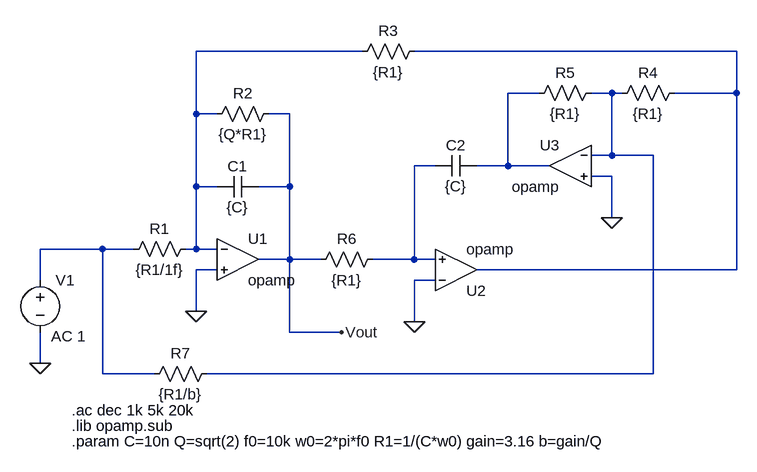
[diagram p0: schematic TS6_standalone.asc]
TS6_standalone.asc, the LTspice schematic file:
Version 4
SHEET 1 880 680
WIRE 96 -160 -160 -160
WIRE 672 -160 176 -160
WIRE 368 -96 320 -96
WIRE 480 -96 448 -96
WIRE 496 -96 480 -96
WIRE 672 -96 672 -160
WIRE 672 -96 576 -96
WIRE -160 -64 -160 -160
WIRE -128 -64 -160 -64
WIRE -16 -64 -48 -64
WIRE 480 0 480 -96
WIRE 480 0 448 0
WIRE 544 0 480 0
WIRE 208 16 176 16
WIRE 320 16 320 -96
WIRE 320 16 272 16
WIRE 384 16 320 16
WIRE 480 32 448 32
WIRE -160 48 -160 -64
WIRE -128 48 -160 48
WIRE -16 48 -16 -64
WIRE -16 48 -64 48
WIRE 480 96 480 32
WIRE -304 144 -400 144
WIRE -256 144 -304 144
WIRE -160 144 -160 48
WIRE -160 144 -176 144
WIRE -128 144 -160 144
WIRE -16 160 -16 48
WIRE -16 160 -64 160
WIRE 32 160 -16 160
WIRE 176 160 176 16
WIRE 176 160 112 160
WIRE 208 160 176 160
WIRE -128 176 -160 176
WIRE 672 176 672 -96
WIRE 672 176 272 176
WIRE -400 192 -400 144
WIRE 208 192 176 192
WIRE -160 240 -160 176
WIRE 176 256 176 192
WIRE -16 272 -16 160
WIRE 64 272 -16 272
WIRE -400 320 -400 272
WIRE -304 336 -304 144
WIRE -224 336 -304 336
WIRE 544 336 544 0
WIRE 544 336 -144 336
FLAG -400 320 0
FLAG -160 240 0
FLAG 176 256 0
FLAG 480 96 0
FLAG 64 272 Vout
SYMBOL OpAmps\\opamp -96 96 R0
SYMATTR InstName U1
SYMBOL voltage -400 176 R0
WINDOW 123 17 102 Left 2
WINDOW 39 0 0 Left 0
SYMATTR Value2 AC 1
SYMATTR InstName V1
SYMATTR Value ""
SYMBOL OpAmps\\opamp 240 240 M180
SYMATTR InstName U2
SYMBOL OpAmps\\opamp 416 -48 M0
SYMATTR InstName U3
SYMBOL res -160 128 R90
WINDOW 0 0 56 VBottom 2
WINDOW 3 32 56 VTop 2
SYMATTR InstName R1
SYMATTR Value {R1/1f}
SYMBOL res -32 -80 R90
WINDOW 0 0 56 VBottom 2
WINDOW 3 32 56 VTop 2
SYMATTR InstName R2
SYMATTR Value {Q*R1}
SYMBOL cap -64 32 R90
WINDOW 0 0 32 VBottom 2
WINDOW 3 32 32 VTop 2
SYMATTR InstName C1
SYMATTR Value {C}
SYMBOL res 192 -176 R90
WINDOW 0 0 56 VBottom 2
WINDOW 3 32 56 VTop 2
SYMATTR InstName R3
SYMATTR Value {R1}
SYMBOL res 592 -112 R90
WINDOW 0 0 56 VBottom 2
WINDOW 3 32 56 VTop 2
SYMATTR InstName R4
SYMATTR Value {R1}
SYMBOL res 464 -112 R90
WINDOW 0 0 56 VBottom 2
WINDOW 3 32 56 VTop 2
SYMATTR InstName R5
SYMATTR Value {R1}
SYMBOL cap 272 0 R90
WINDOW 0 0 32 VBottom 2
WINDOW 3 32 32 VTop 2
SYMATTR InstName C2
SYMATTR Value {C}
SYMBOL res 128 144 R90
WINDOW 0 0 56 VBottom 2
WINDOW 3 32 56 VTop 2
SYMATTR InstName R6
SYMATTR Value {R1}
SYMBOL res -128 320 R90
WINDOW 0 0 56 VBottom 2
WINDOW 3 32 56 VTop 2
SYMATTR InstName R7
SYMATTR Value {R1/b}
TEXT -352 392 Left 2 !.ac dec 1k 5k 20k
TEXT -352 416 Left 2 !.lib opamp.sub
TEXT -352 440 Left 2 !.param C=10n Q=sqrt(2) f0=10k w0=2*pi*f0 R1=1/(C*w0) gain=3.16 b=gain/Q

The netlist it stands for:
* TS6_standalone.asc
XU1 N001 0 Vout opamp Aol=100K GBW=10Meg  ; pins invin noninvin out
V1 N006 0 AC 1
XU2 0 N005 N002 opamp Aol=100K GBW=10Meg  ; pins invin noninvin out
XU3 N004 0 N003 opamp Aol=100K GBW=10Meg  ; pins invin noninvin out
R1 N001 N006 {R1/1f}
R2 Vout N001 {Q*R1}
C1 Vout N001 {C}
R3 N002 N001 {R1}
R4 N002 N004 {R1}
R5 N004 N003 {R1}
C2 N003 N005 {C}
R6 N005 Vout {R1}
R7 N004 N006 {R1/b}
.ac dec 1k 5k 20k
.lib opamp.sub
.param C=10n Q=sqrt(2) f0=10k w0=2*pi*f0 R1=1/(C*w0) gain=3.16 b=gain/Q
.backanno
.end